# EAGLE schematic internship_emu - Copy (EAGLE 9.5.0)
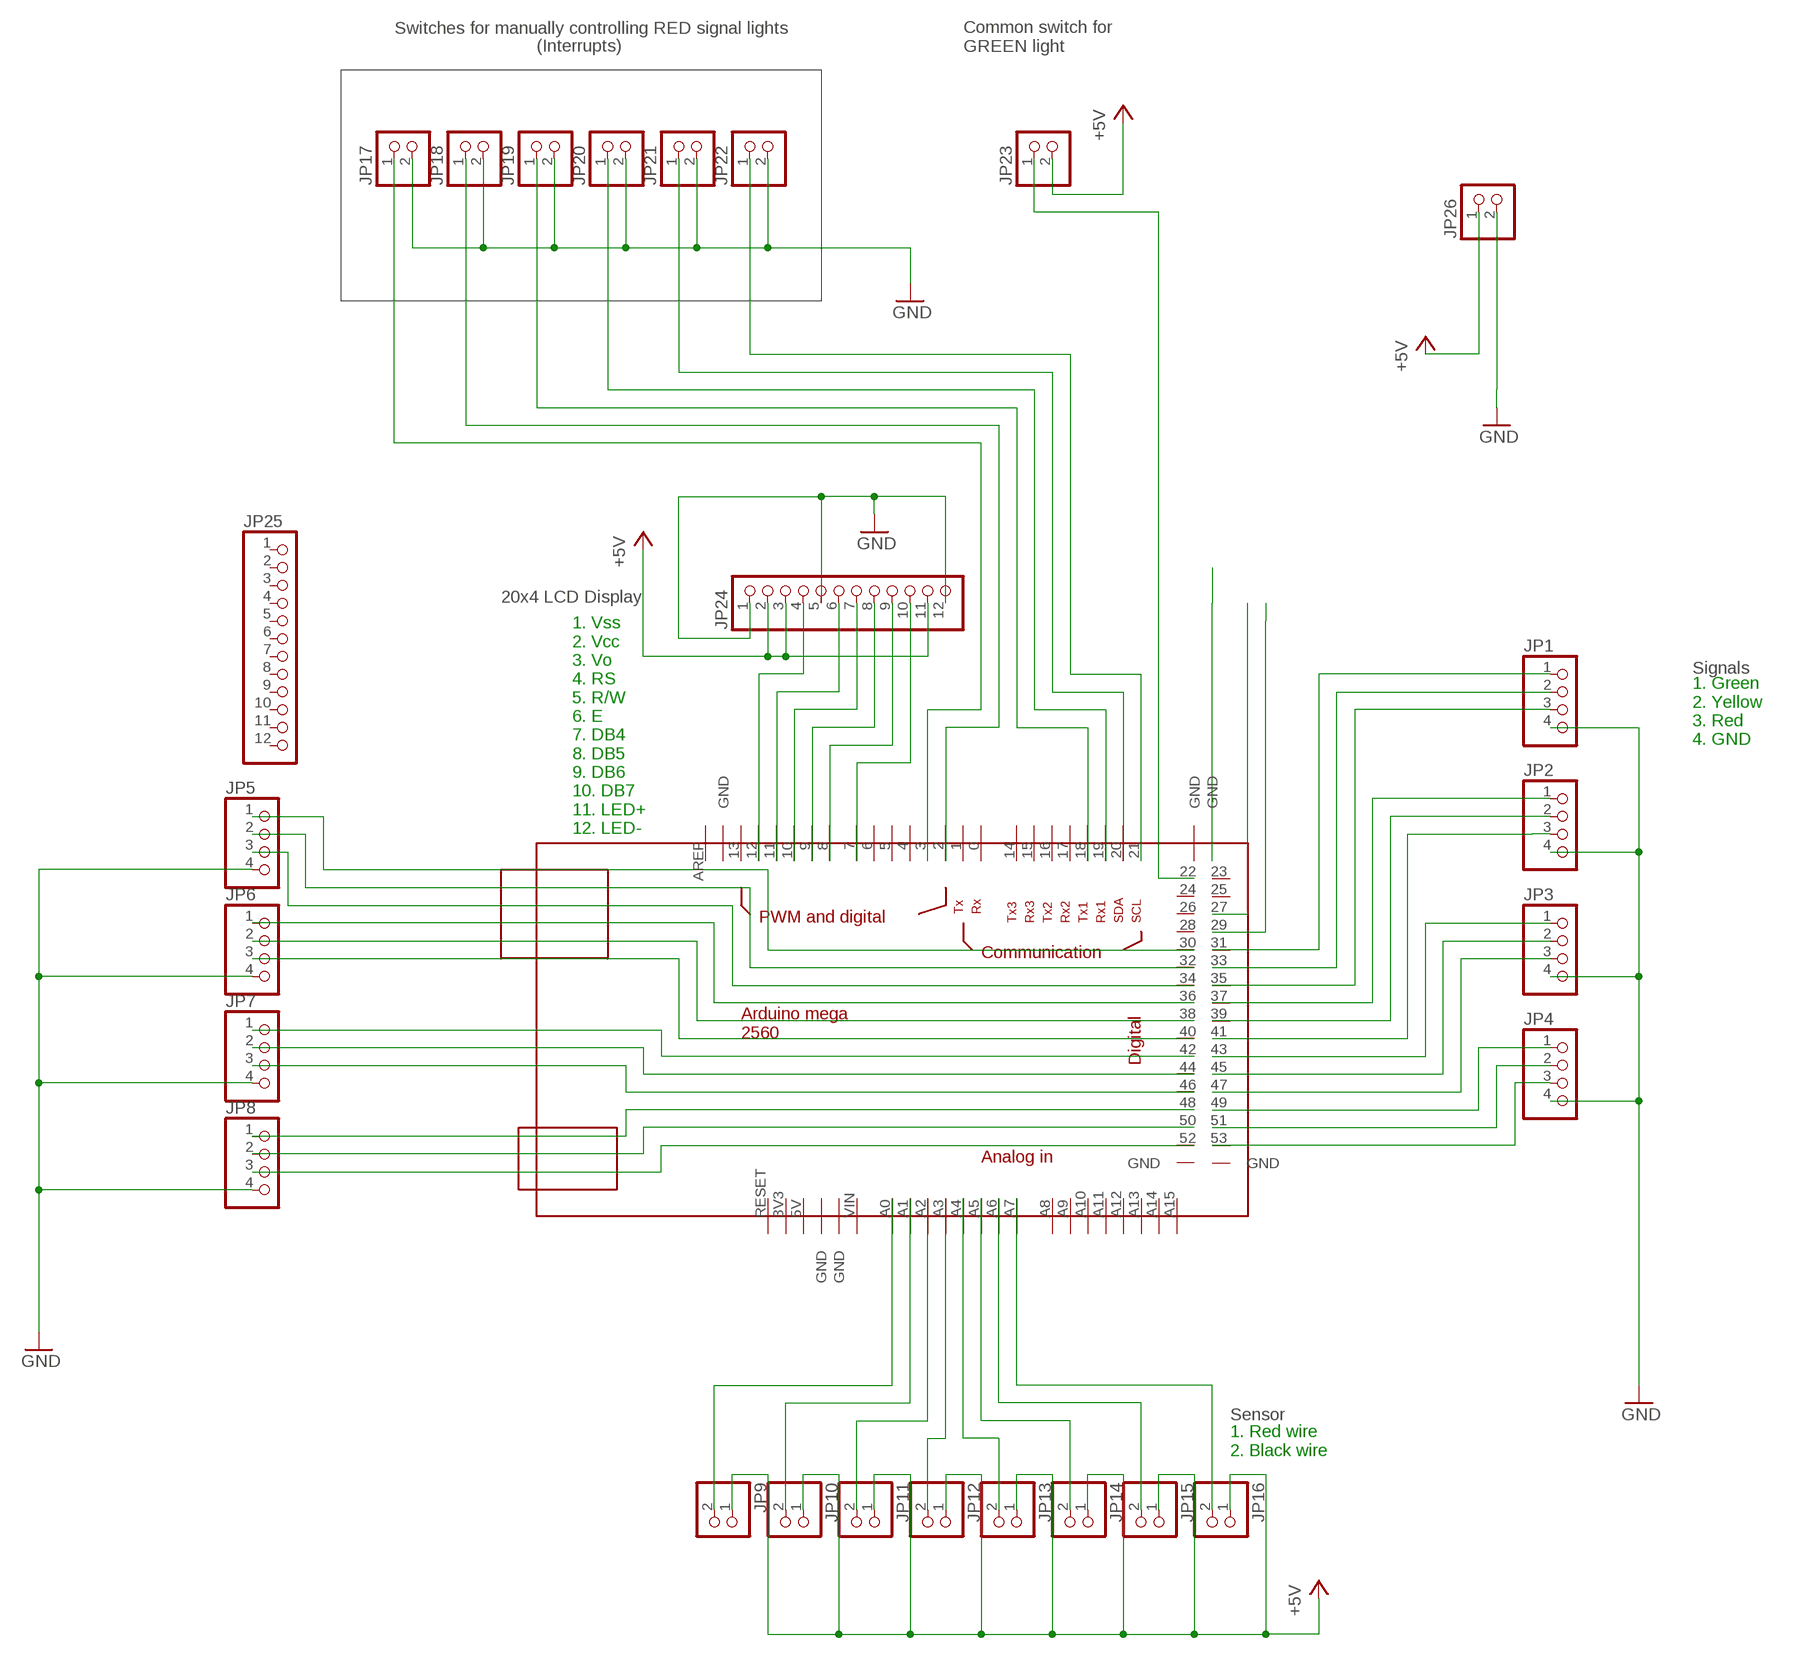
[diagram p0: schematic, sheet 1]

## Parts
JP1  PINHD-1X4  [1X04]
JP2  PINHD-1X4  [1X04]
JP3  PINHD-1X4  [1X04]
JP4  PINHD-1X4  [1X04]
JP5  PINHD-1X4  [1X04]
JP6  PINHD-1X4  [1X04]
JP7  PINHD-1X4  [1X04]
JP8  PINHD-1X4  [1X04]
JP9  PINHD-1X2  [1X02]
JP10  PINHD-1X2  [1X02]
JP11  PINHD-1X2  [1X02]
JP12  PINHD-1X2  [1X02]
JP13  PINHD-1X2  [1X02]
JP14  PINHD-1X2  [1X02]
JP15  PINHD-1X2  [1X02]
JP16  PINHD-1X2  [1X02]
JP17  PINHD-1X2  [1X02]
JP18  PINHD-1X2  [1X02]
JP19  PINHD-1X2  [1X02]
JP20  PINHD-1X2  [1X02]
JP21  PINHD-1X2  [1X02]
JP22  PINHD-1X2  [1X02]
JP23  PINHD-1X2  [1X02]
JP24  PINHD-1X12  [1X12]
JP25  PINHD-1X12  [1X12]
JP26  PINHD-1X2  [1X02]
U$1  MEGA_DEVICE  [MEGAOUTLINE]

## Nets
+5V: JP9.1 JP10.1 JP11.1 JP12.1 JP13.1 JP14.1 JP15.1 JP16.1 JP23.2 JP24.2 JP24.3 JP24.11 JP26.1
GND: JP1.4 JP2.4 JP3.4 JP4.4 JP5.4 JP6.4 JP7.4 JP8.4 JP17.2 JP18.2 JP19.2 JP20.2 JP21.2 JP22.2 JP24.1 JP24.5 JP24.12 JP26.2
N$1: JP4.3 U$1.53
N$2: JP4.2 U$1.51
N$3: JP4.1 U$1.49
N$4: JP3.3 U$1.47
N$5: JP3.2 U$1.45
N$6: JP3.1 U$1.43
N$7: JP2.3 U$1.41
N$8: JP2.2 U$1.39
N$9: JP2.1 U$1.37
N$10: JP1.3 U$1.35
N$11: JP1.2 U$1.33
N$12: JP1.1 U$1.31
N$13: JP6.3 U$1.40
N$14: U$1.GND@5(GND)
N$15: U$1.29
N$16: U$1.27
N$18: JP8.3 U$1.52
N$19: JP8.2 U$1.50
N$20: JP8.1 U$1.48
N$21: JP7.3 U$1.46
N$22: JP7.2 U$1.44
N$23: JP7.1 U$1.42
N$24: JP6.2 U$1.38
N$25: JP9.2 U$1.A0
N$26: JP10.2 U$1.A1
N$27: JP11.2 U$1.A2
N$28: JP12.2 U$1.A3
N$29: JP13.2 U$1.A4
N$30: JP14.2 U$1.A5
N$31: JP15.2 U$1.A6
N$32: JP16.2 U$1.A7
N$33: JP23.1 U$1.22
N$34: JP6.1 U$1.36
N$35: JP5.3 U$1.34
N$36: JP24.4 U$1.12
N$37: JP24.6 U$1.11
N$38: JP24.7 U$1.10
N$39: JP24.8 U$1.9
N$40: JP24.9 U$1.8
N$41: JP24.10 U$1.7
N$42: JP5.2 U$1.32
N$43: JP5.1 U$1.30
N$49: JP19.1 U$1.18
N$50: JP17.1 U$1.3
N$51: JP18.1 U$1.2
N$52: JP20.1 U$1.19
N$53: JP21.1 U$1.20
N$54: JP22.1 U$1.21
Unconnected: JP25.1 JP25.2 JP25.3 JP25.4 JP25.5 JP25.6 JP25.7 JP25.8 JP25.9 JP25.10 JP25.11 JP25.12 U$1.0 U$1.1 U$1.3V3 U$1.4 U$1.5 U$1.5V U$1.6 U$1.13 U$1.14 U$1.15 U$1.16 U$1.17 U$1.23 U$1.24 U$1.25 U$1.26 U$1.28 U$1.A8 U$1.A9 U$1.A10 U$1.A11 U$1.A12 U$1.A13 U$1.A14 U$1.A15 U$1.AREF U$1.GND@1(GND) U$1.GND@2(GND) U$1.GND@3(GND) U$1.GND@4(GND) U$1.GND@6(GND) U$1.GND@7(GND) U$1.RESET U$1.VIN

## Notes on the sheet
- Switches for manually controlling RED signal lights
- (Interrupts)
- Common switch for 
  GREEN light
- 20x4 LCD Display
- Signals
- 1. Green
  2. Yellow
  3. Red
  4. GND
- 1. Vss
  2. Vcc
  3. Vo
  4. RS
  5. R/W
  6. E
  7. DB4
  8. DB5
  9. DB6
  10. DB7
  11. LED+
  12. LED-
- Sensor
- 1. Red wire
  2. Black wire

## Library data of the parts
JP1-JP8 = pinhead:PINHD-1X4: PIN HEADER
JP9-JP23 JP26 = pinhead:PINHD-1X2: PIN HEADER
JP24 JP25 = pinhead:PINHD-1X12: PIN HEADER
U$1 = ArduinoMegaOutline:MEGA_DEVICE: mega card as device